# EAGLE design Shield_Carrito (EAGLE 9.5.1)
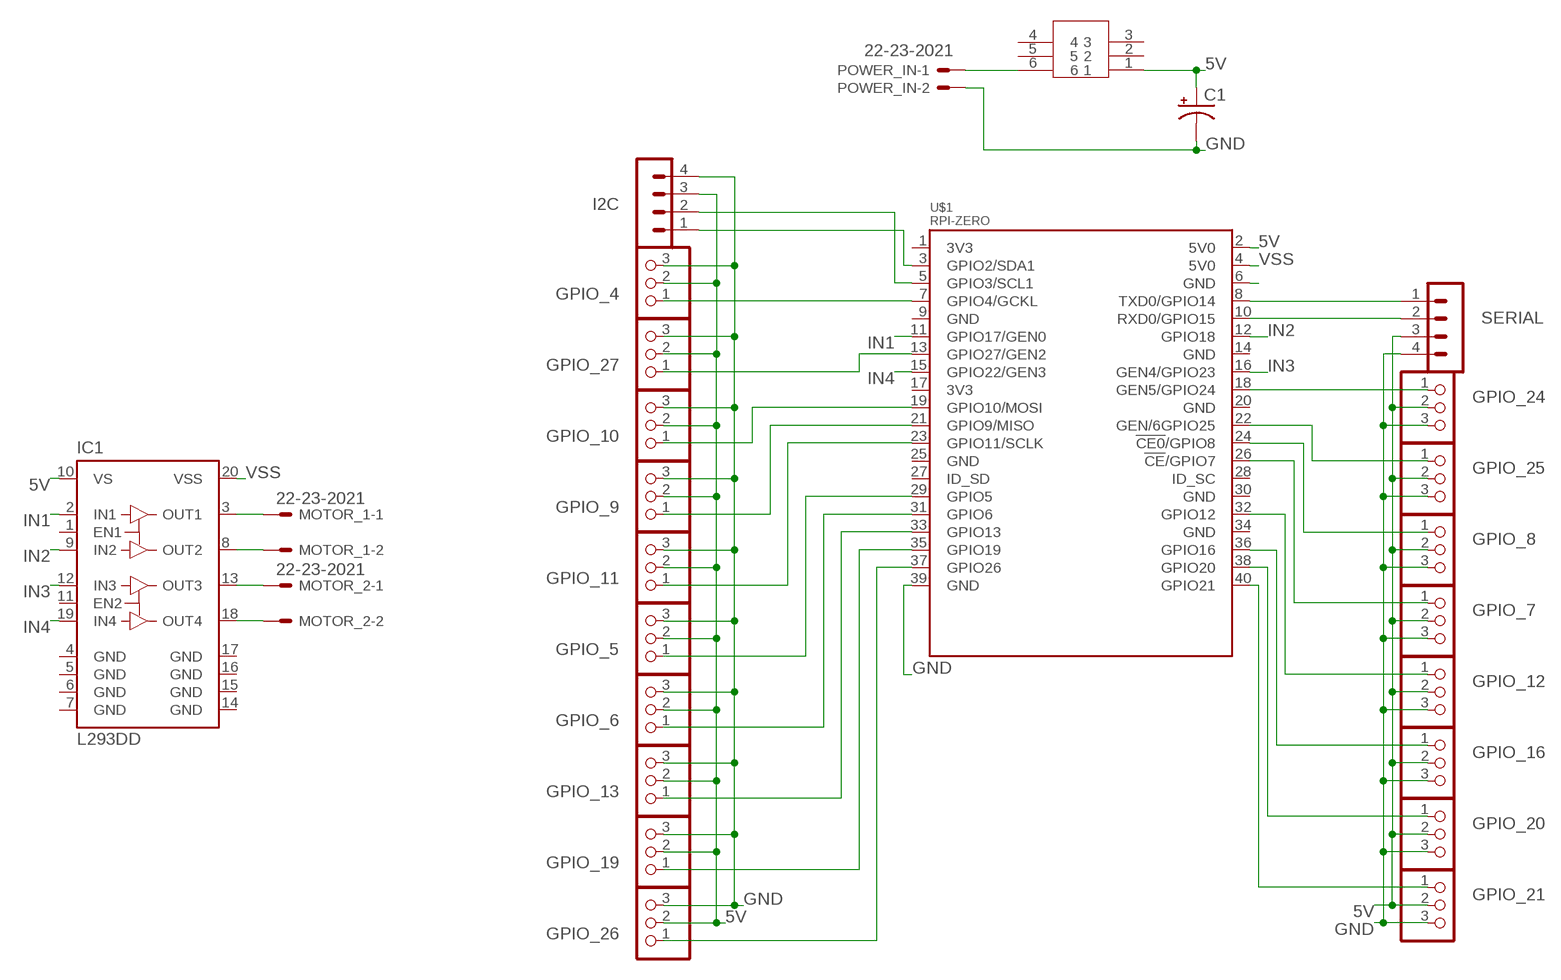
[diagram p0: schematic, sheet 1]

## Parts
C1  CPOL-USE2,5-6E  [E2,5-6E]
GPIO_4  PINHD-1X3  [1X03]
GPIO_5  PINHD-1X3  [1X03]
GPIO_6  PINHD-1X3  [1X03]
GPIO_7  PINHD-1X3  [1X03]
GPIO_8  PINHD-1X3  [1X03]
GPIO_9  PINHD-1X3  [1X03]
GPIO_10  PINHD-1X3  [1X03]
GPIO_11  PINHD-1X3  [1X03]
GPIO_12  PINHD-1X3  [1X03]
GPIO_13  PINHD-1X3  [1X03]
GPIO_16  PINHD-1X3  [1X03]
GPIO_19  PINHD-1X3  [1X03]
GPIO_20  PINHD-1X3  [1X03]
GPIO_21  PINHD-1X3  [1X03]
GPIO_24  PINHD-1X3  [1X03]
GPIO_25  PINHD-1X3  [1X03]
GPIO_26  PINHD-1X3  [1X03]
GPIO_27  PINHD-1X3  [1X03]
I2C  MA04-1  [MA04-1]
IC1  L293DD  [SO20]
MOTOR_1  22-23-2021  [22-23-2021]
MOTOR_2  22-23-2021  [22-23-2021]
POWER_IN  22-23-2021  [22-23-2021]
SERIAL  MA04-1  [MA04-1]
U$1  RPI-ZERO  [RASPBERRYPI_BASTELSTUBE_V13_RASPI_BOARD_B+_FULL]
U$2  PUSH_SWITCH_8X8  [PUSH_SWITCH_8X8]

## Nets
5V: C1.+ GPIO_4.2 GPIO_5.2 GPIO_6.2 GPIO_7.2 GPIO_8.2 GPIO_9.2 GPIO_10.2 GPIO_11.2 GPIO_12.2 GPIO_13.2 GPIO_16.2 GPIO_19.2 GPIO_20.2 GPIO_21.2 GPIO_24.2 GPIO_25.2 GPIO_26.2 GPIO_27.2 I2C.3 IC1.10(VS) SERIAL.3 U$1.2(5V0) U$2.1
GND: C1.- GPIO_4.3 GPIO_5.3 GPIO_6.3 GPIO_7.3 GPIO_8.3 GPIO_9.3 GPIO_10.3 GPIO_11.3 GPIO_12.3 GPIO_13.3 GPIO_16.3 GPIO_19.3 GPIO_20.3 GPIO_21.3 GPIO_24.3 GPIO_25.3 GPIO_26.3 GPIO_27.3 I2C.4 POWER_IN.2 SERIAL.4 U$1.6(GND) U$1.39(GND)
IN1: IC1.2(IN1) U$1.11(GPIO17/GEN0)
IN2: IC1.9(IN2) U$1.12(GPIO18)
IN3: IC1.12(IN3) U$1.16(GEN4/GPIO23)
IN4: IC1.19(IN4) U$1.15(GPIO22/GEN3)
N$1: GPIO_26.1 U$1.37(GPIO26)
N$2: GPIO_24.1 U$1.18(GEN5/GPIO24)
N$3: GPIO_25.1 U$1.22(GEN/6GPIO25)
N$4: GPIO_12.1 U$1.32(GPIO12)
N$5: GPIO_16.1 U$1.36(GPIO16)
N$7: GPIO_20.1 U$1.38(GPIO20)
N$8: GPIO_21.1 U$1.40(GPIO21)
N$10: GPIO_8.1 U$1.24(!CE0!/GPIO8)
N$11: GPIO_7.1 U$1.26(!CE!/GPIO7)
N$12: POWER_IN.1 U$2.6
N$15: IC1.13(OUT3) MOTOR_2.1
N$16: IC1.18(OUT4) MOTOR_2.2
N$17: IC1.3(OUT1) MOTOR_1.1
N$18: GPIO_27.1 U$1.13(GPIO27/GEN2)
N$19: GPIO_10.1 U$1.19(GPIO10/MOSI)
N$20: GPIO_11.1 U$1.23(GPIO11/SCLK)
N$21: GPIO_9.1 U$1.21(GPIO9/MISO)
N$22: GPIO_5.1 U$1.29(GPIO5)
N$23: GPIO_6.1 U$1.31(GPIO6)
N$24: GPIO_13.1 U$1.33(GPIO13)
N$25: GPIO_19.1 U$1.35(GPIO19)
N$26: GPIO_4.1 U$1.7(GPIO4/GCKL)
N$27: IC1.8(OUT2) MOTOR_1.2
N$28: I2C.2 U$1.5(GPIO3/SCL1)
N$30: I2C.1 U$1.3(GPIO2/SDA1)
N$31: SERIAL.1 U$1.8(TXD0/GPIO14)
N$32: SERIAL.2 U$1.10(RXD0/GPIO15)
VSS: IC1.20(VSS) U$1.4(5V0)
Unconnected: IC1.1(EN1) IC1.11(EN2) U$1.1(3V3) U$1.9(GND) U$1.14(GND) U$1.17(3V3) U$1.20(GND) U$1.25(GND) U$1.27(ID_SD) U$1.28(ID_SC) U$1.30(GND) U$1.34(GND) U$2.2 U$2.3 U$2.4 U$2.5

## Power pins joined to a net without a drawn wire
GND: IC1.4(GND) IC1.5(GND) IC1.6(GND) IC1.7(GND) IC1.14(GND) IC1.15(GND) IC1.16(GND) IC1.17(GND)

## Library data of the parts
C1 = rcl:CPOL-US: POLARIZED CAPACITOR, American symbol; SPICEPREFIX: C
GPIO_4-GPIO_13 GPIO_16 GPIO_19-GPIO_21 GPIO_24-GPIO_27 = adafruit:PINHD-1X3: PIN HEADER
I2C SERIAL = con-lstb:MA04-1: PIN HEADER; OC_FARNELL: unknown; OC_NEWARK: unknown
IC1 = st-microelectronics:L293DD: PUSH-PULL FOUR CHANNEL DRIVER WITH DIODES Source: http://www.st.com/stonline/books/pdf/docs/1330.pdf; OC_FARNELL: unknown
MOTOR_1 MOTOR_2 POWER_IN = con-molex:22-23-2021: .100" (2.54mm) Center Header - 2 Pin; MF: MOLEX; MPN: 22-23-2021; OC_FARNELL: 1462926; OC_NEWARK: 25C3832
U$1 = RASPBERRY_PI-Zero:RPI-ZERO
U$2 = Push_switch:PUSH_SWITCH_8X8

## Board
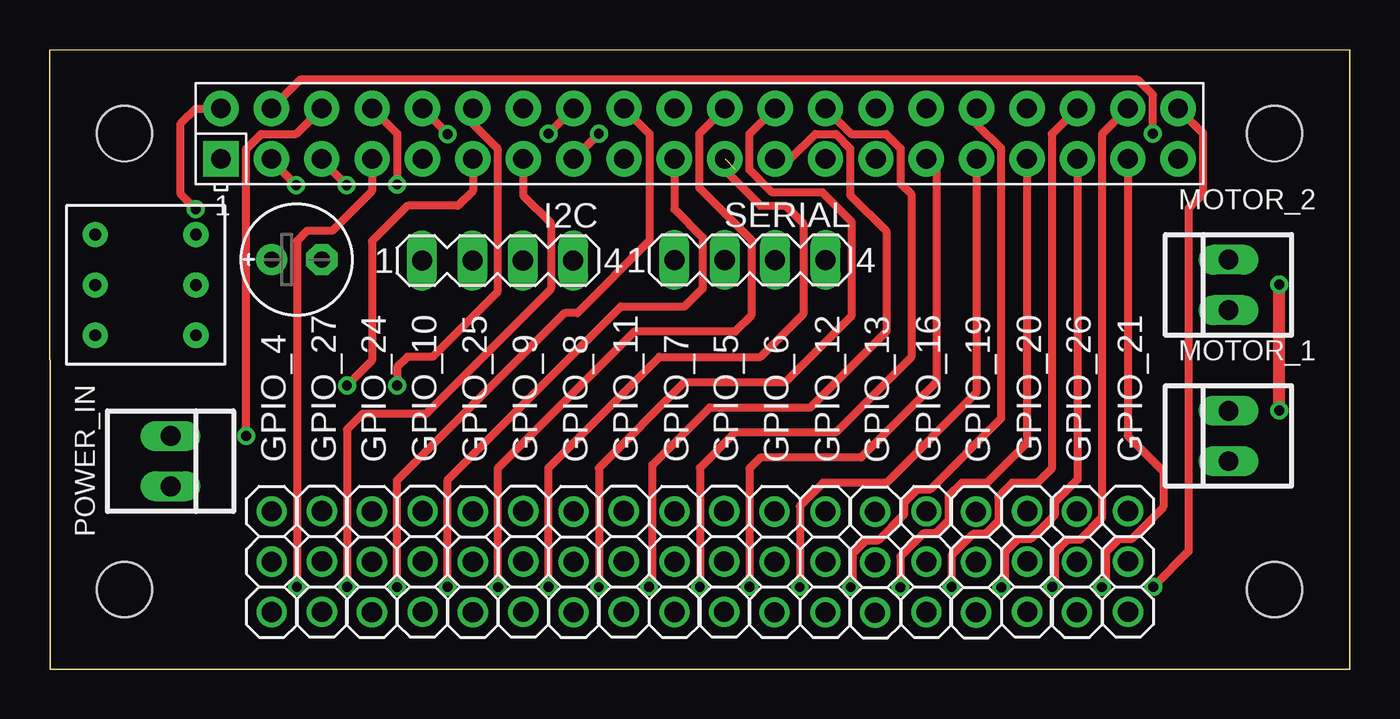
[diagram p1: board, top side]
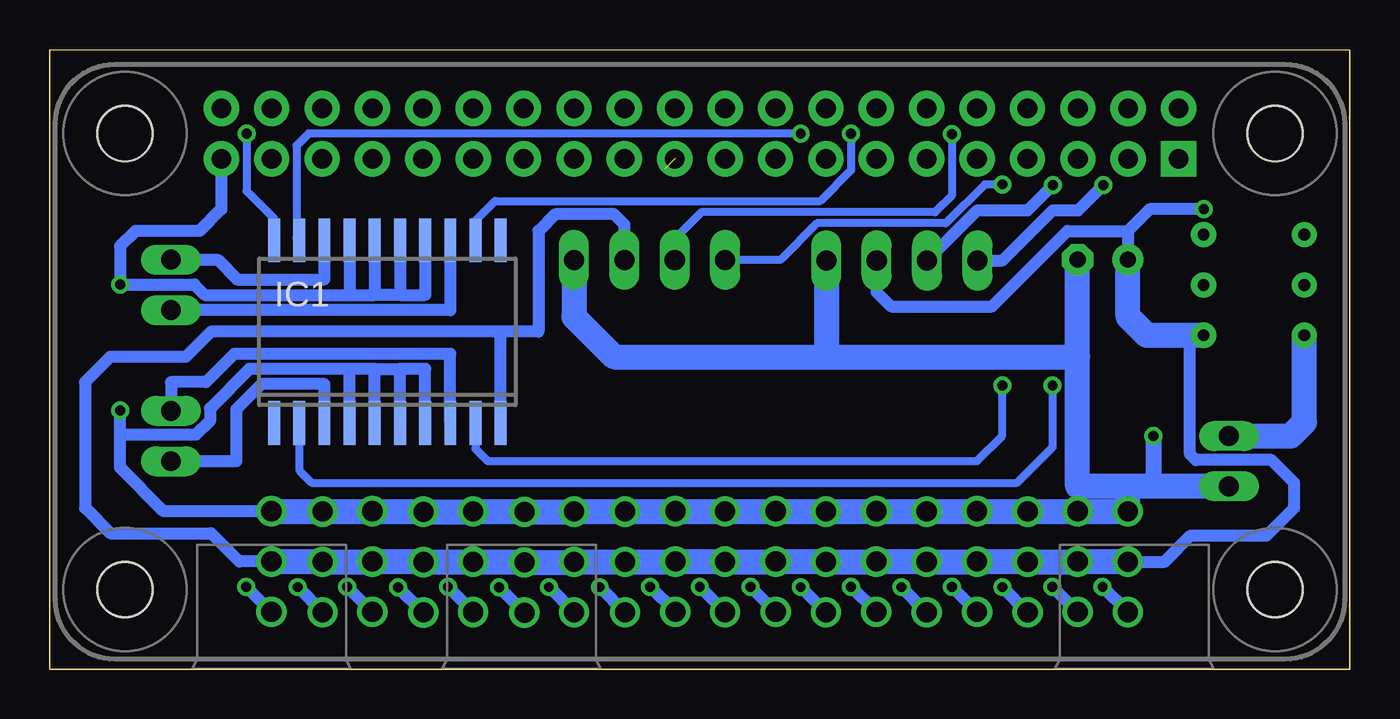
[diagram p2: board, bottom side, seen from below]

Size 65.56 x 31.26 mm. Coordinates in mm from the lower left corner, seen from the top.
Outline: 65.55,0 65.56,31.26 0,31.23 0.02,0 65.55,0
Copper layers (1*16): Top 0.035mm / dielectric 1.5mm / Bottom 0.035mm
Design rules "default": minimum track width 6mil, minimum drill 0.35mm, track to track 6mil, track to pad 6mil, pad to pad 6mil, via to via 6mil, smd to smd 6mil, copper to edge 40mil, drill to drill 6mil, minimum pad ring 10mil, minimum via ring 8mil, stop-mask expansion 4mil, vias tented up to drill 0mil, thermal gap 10mil
Holes 2.8 mm at 3.77,27.02 3.77,4.02 61.77,27.02 61.77,4.02

### Footprints (pad centres in the part's own frame; a part is rotated, then mirrored left to right if it is on the bottom)
E2,5-6E = drill 0.813 pad 1.575: + -1.27,0 | drill 0.813 pad 1.575 octagon: - 1.27,0
1X03 = drill 1.016: 1 -2.54,0; 2 0,0; 3 2.54,0
MA04-1 = drill 1.016 long: 1 -3.81,0; 2 -1.27,0; 3 1.27,0; 4 3.81,0
SO20 = smd 0.6 x 2.2: 1 -5.715,-4.6; 2 -4.445,-4.6; 3 -3.175,-4.6; 4 -1.905,-4.6; 5 -0.635,-4.6; 6 0.635,-4.6; 7 1.905,-4.6; 8 3.175,-4.6; 9 4.445,-4.6; 10 5.715,-4.6; 11 5.715,4.6; 12 4.445,4.6; 13 3.175,4.6; 14 1.905,4.6; 15 0.635,4.6; 16 -0.635,4.6; 17 -1.905,4.6; 18 -3.175,4.6; 19 -4.445,4.6; 20 -5.715,4.6
22-23-2021 = drill 1 long: 1 -1.27,0; 2 1.27,0
RASPBERRYPI_BASTELSTUBE_V13_RASPI_BOARD_B+_FULL = drill 1 pad 1.778 square: 1 8.37,25.23 | drill 1 pad 1.778: 2 8.37,27.77; 3 10.91,25.23; 4 10.91,27.77; 5 13.45,25.23; 6 13.45,27.77; 7 15.99,25.23; 8 15.99,27.77; 9 18.53,25.23; 10 18.53,27.77; 11 21.07,25.23; 12 21.07,27.77; 13 23.61,25.23; 14 23.61,27.77; 15 26.15,25.23; 16 26.15,27.77; 17 28.69,25.23; 18 28.69,27.77; 19 31.23,25.23; 20 31.23,27.77; 21 33.77,25.23; 22 33.77,27.77; 23 36.31,25.23; 24 36.31,27.77; 25 38.85,25.23; 26 38.85,27.77; 27 41.39,25.23; 28 41.39,27.77; 29 43.93,25.23; 30 43.93,27.77; 31 46.47,25.23; 32 46.47,27.77; 33 49.01,25.23; 34 49.01,27.77; 35 51.55,25.23; 36 51.55,27.77; 37 54.09,25.23; 38 54.09,27.77; 39 56.63,25.23; 40 56.63,27.77 | hole 2.75: 3.5,3.5; 3.5,26.5; 61.5,3.5; 61.5,26.5
PUSH_SWITCH_8X8 = drill 0.6 pad 1.27: 1 -2.54,2.54; 2 -2.54,0; 3 -2.54,-2.54; 4 2.54,-2.54; 5 2.54,0; 6 2.54,2.54

### Placement (x,y rotation side)
C1  12.46,20.67 0 top
GPIO_4  11.2,5.43 90 top
GPIO_5  34.01,5.44 90 top
GPIO_6  36.55,5.42 90 top
GPIO_7  31.51,5.43 90 top
GPIO_8  26.42,5.42 90 top
GPIO_9  23.88,5.44 90 top
GPIO_10  18.8,5.44 90 top
GPIO_11  28.95,5.44 90 top
GPIO_12  39.12,5.42 90 top
GPIO_13  41.62,5.4 90 top
GPIO_16  44.21,5.43 90 top
GPIO_19  46.71,5.41 90 top
GPIO_20  49.29,5.44 90 top
GPIO_21  54.38,5.44 90 top
GPIO_24  16.25,5.42 90 top
GPIO_25  21.34,5.42 90 top
GPIO_26  51.79,5.42 90 top
GPIO_27  13.73,5.44 90 top
I2C  22.59,20.62 0 top
IC1  48.53,17.03 0 bottom
MOTOR_1  59.44,11.77 90 top
MOTOR_2  59.44,19.39 90 top
POWER_IN  6.1,10.5 270 top
SERIAL  35.31,20.65 0 top
U$1  0.27,0.52 0 top
U$2  4.84,19.39 180 top

### Tracks (layer width: path | path; a pad name or v marks a point on that pad's centre or on a via)
5V  (via drill 0.5)
  Top 0.406: v7.37,23.21 6.62,23.96 6.62,27.54 7.37,28.29 U$1.2
  Bottom 0.406: 54.41,5.44 GPIO_21.2
  Bottom 0.61: GPIO_21.2 55.99,5.44 57.42,6.87 62.5,6.87 63.77,8.14 63.77,14.49 62.5,15.76 58.69,15.76 57.42,17.03 42.82,17.03 | IC1.10 42.82,17.03 | SERIAL.3 36.58,22.44 37.1,22.96 40.06,22.96 40.91,22.11 40.91,17.03 42.82,17.03 | I2C.3 23.86,19.03 23.13,18.3 18.05,18.3 14.24,22.11 11.19,22.11 | 11.19,22.11 C1.+ | v7.37,23.21 10.09,23.21 11.19,22.11 | GPIO_4.2 9.33,5.43 8.01,6.75 4.2,6.75 2.81,8.14 2.81,9.41 3.96,10.56 7.77,10.56 8.06,10.86 8.06,16.85 9.16,16.85
  Bottom 1.27: U$2.1 9.16,16.85 10.25,16.85 11.19,17.79 C1.+ | GPIO_21.2 51.79,5.44 GPIO_26.2 49.29,5.42 GPIO_20.2 46.71,5.44 GPIO_19.2 44.21,5.41 GPIO_16.2 41.62,5.43 GPIO_13.2 39.12,5.4 GPIO_12.2 GPIO_6.2 34.01,5.42 GPIO_5.2 GPIO_7.2 GPIO_11.2 26.42,5.44 GPIO_8.2 23.88,5.42 GPIO_9.2 21.34,5.44 GPIO_25.2 18.8,5.42 GPIO_10.2 16.25,5.44 GPIO_24.2 13.73,5.42 GPIO_27.2 GPIO_4.2
GND  (via drill 0.5)
  Top 0.406: U$1.6 12.42,27 10.66,27 9.91,26.24 v9.91,11.78
  Top 0.61: v62,13.06 v62,19.41
  Bottom 0.406: GPIO_21.3 54.38,8.14
  Bottom 0.61: IC1.7 46.62,15.15 47.9,15.15 | 49.17,15.15 50.44,15.15 | 50.44,15.15 55.49,15.15 57.48,13.16 57.48,12.54 58.18,11.83 61.88,11.83 62,11.95 | IC1.6 47.9,15.15 | IC1.5 49.17,15.15 | 49.17,15.15 47.9,15.15 | IC1.4 50.44,15.15 | GPIO_21.3 59.8,7.98 62,10.18 62,11.95 | IC1.14 46.62,18.88 47.9,18.88 | 47.9,18.88 49.17,18.88 | 50.44,18.88 57.74,18.88 58.26,19.41 v62,19.41 62,21.34 61.23,22.11 58,22.11 56.9,23.21 U$1.39 | IC1.15 47.9,18.88 | IC1.16 49.17,18.88 | IC1.17 50.44,18.88 | 50.44,18.88 49.17,18.88 | 62,11.95 v62,13.06
  Bottom 0.813: v9.91,11.78 9.91,9.23 9.16,9.23
  Bottom 1.27: POWER_IN.2 9.16,9.23 11.2,9.23 | 11.2,9.23 13.73,9.23 13.73,15.76 | 13.73,15.76 C1.- | GPIO_21.3 51.79,7.98 GPIO_26.3 49.29,7.96 GPIO_20.3 46.71,7.98 GPIO_19.3 44.21,7.95 GPIO_16.3 41.62,7.97 GPIO_13.3 39.12,7.94 GPIO_12.3 GPIO_6.3 34.01,7.96 GPIO_5.3 GPIO_7.3 GPIO_11.3 26.42,7.98 GPIO_8.3 23.88,7.96 GPIO_9.3 21.34,7.98 GPIO_25.3 18.8,7.96 GPIO_10.3 16.25,7.98 GPIO_24.3 13.73,7.96 GPIO_27.3 GPIO_4.3 11.2,9.23 | SERIAL.4 39.12,17.78 37.1,15.76 26.4,15.76 | 26.4,15.76 13.73,15.76 | I2C.4 26.4,15.76
IN1  (via drill 0.5)
  Top 0.406: U$1.11 21.34,24.13 20.59,23.38 18.05,23.38 16.26,21.59 16.26,15.59 v14.99,14.32
  Bottom 0.406: IC1.2 52.98,10.04 52.34,9.41 16.78,9.41 14.99,11.2 v14.99,14.32
IN2  (via drill 0.5)
  Top 0.406: U$1.12 21.34,27.51 22.59,26.27 22.59,19.02 19.32,15.76 18.05,15.76 17.53,15.24 v17.53,14.32
  Bottom 0.406: IC1.9 44.09,11.13 43.47,10.51 18.8,10.51 17.53,11.78 v17.53,14.32
IN3  (via drill 0.5)
  Top 0.406: v25.15,27.02 U$1.16
  Bottom 0.406: v25.15,27.02 25.15,25.17 26.7,23.62 43.1,23.62 44.09,22.63 IC1.12
IN4  (via drill 0.5)
  Top 0.406: v27.69,27.02 U$1.15
  Bottom 0.406: v27.69,27.02 52.51,27.02 53.12,26.41 53.12,21.77 IC1.19
N$1  (via drill 0.5)
  Top 0.406: U$1.37 54.36,11.78 56.15,9.99 56.15,8.17 54.54,6.56 53.92,6.56 53.26,5.9 53.26,4.35 v53.06,4.15
  Bottom 0.61: v53.06,4.15 GPIO_26.1
N$2  (via drill 0.5)
  Top 0.406: U$1.18 30.25,27 30.25,21.61 26.61,17.97 25.96,17.97 17.52,9.53 v17.52,4.15
  Bottom 0.61: GPIO_24.1 v17.52,4.15
N$3  (via drill 0.5)
  Top 0.406: U$1.22 32.75,27 32.75,24.29 35.38,21.66 | 35.38,21.66 35.46,21.57 | v22.61,4.15 22.61,10.16 29.48,17.03 34.56,17.03 35.38,17.85 35.38,21.66
  Bottom 0.61: GPIO_25.1 v22.61,4.15
N$4  (via drill 0.5)
  Top 0.406: U$1.32 46.74,27.51 47.99,26.27 47.99,12.67 44.4,9.09 43.75,9.09 43.09,8.43 43.09,7.83 41.78,6.52 41.16,6.52 40.5,5.86 40.5,4.26 v40.39,4.15
  Bottom 0.61: v40.39,4.15 GPIO_12.1
N$5  (via drill 0.5)
  Top 0.406: U$1.36 50.53,27 50.53,10.13 49.8,9.41 48.53,9.41 47.83,8.71 47.83,7.49 47.17,6.83 46.55,6.83 45.48,5.76 v45.48,4.16
  Bottom 0.61: v45.48,4.16 GPIO_16.1
N$7  (via drill 0.5)
  Top 0.406: U$1.38 53.07,27 53.07,7.65 51.95,6.54 51.33,6.54 50.67,5.88 50.67,4.28 v50.56,4.17
  Bottom 0.61: v50.56,4.17 GPIO_20.1
N$8  (via drill 0.5)
  Top 0.406: U$1.40 58.15,27.04 58.15,23.96 57.42,23.24 57.42,5.94 v55.65,4.17
  Bottom 0.61: v55.65,4.17 GPIO_21.1
N$10  (via drill 0.5)
  Top 0.406: v27.69,4.15 27.69,10.16 32.02,14.49 37.1,14.49 40.45,17.85 40.45,22.57 38.97,24.05 37.1,24.05 36.59,24.05 36.43,24.05 35.29,25.2 35.29,27 U$1.24
  Bottom 0.61: GPIO_8.1 v27.69,4.15
N$11  (via drill 0.5)
  Top 0.406: U$1.26 39.86,27.55 39.87,27.55 40.43,27 42.18,27 42.91,26.27 42.91,24.5 43.45,23.96 43.45,15.76 39.64,11.95 34.56,11.95 32.78,10.17 v32.78,4.16
  Bottom 0.61: GPIO_7.1 v32.78,4.16
N$12
  Bottom 1.27: POWER_IN.1 2.99,11.77 2.3,12.46 U$2.6
N$15
  Bottom 0.61: IC1.13 45.36,18.12 MOTOR_2.1
N$16
  Bottom 0.61: IC1.18 51.71,19.67 56.11,19.67 57.1,20.66 MOTOR_2.2
N$17
  Bottom 0.61: IC1.3 51.71,14.39 54.88,14.39 56.15,13.12 56.15,10.5 MOTOR_1.1
N$18  (via drill 0.5)
  Top 0.406: U$1.13 23.88,23.9 25.28,22.5 25.28,19.18 18.99,12.89 15.79,12.89 15,12.1 v15,4.17
  Bottom 0.61: GPIO_27.1 v15,4.17
N$19  (via drill 0.5)
  Top 0.406: U$1.19 31.5,23.21 32.92,21.79 32.92,19.2 32.02,18.3 28.81,18.3 20.07,9.56 v20.07,4.17
  Bottom 0.61: GPIO_10.1 v20.07,4.17
N$20  (via drill 0.5)
  Top 0.406: U$1.23 37.36,25.75 38.6,27 39.64,27 40.37,26.27 40.37,23.93 42.18,22.11 42.18,17.03 38.37,13.22 33.29,13.22 30.39,10.32 30.39,4.34 v30.22,4.17
  Bottom 0.61: GPIO_11.1 v30.22,4.17
N$21  (via drill 0.5)  (1 unrouted)
  Top 0.305: 34.56,25.23
  Top 0.406: U$1.21 34.04,25.17 35.83,23.38 37.1,23.38 38,22.48 38,17.93 35.83,15.76 30.75,15.76 25.15,10.16 v25.15,4.17
  Bottom 0.61: GPIO_9.1 v25.15,4.17
N$22  (via drill 0.5)
  Top 0.406: v35.28,4.17 35.28,10.13 35.83,10.68 40.91,10.68 44.72,14.49 44.72,25.23 U$1.29
  Bottom 0.61: GPIO_5.1 v35.28,4.17
N$23  (via drill 0.5)
  Top 0.406: U$1.31 46.74,13.97 42.18,9.41 38.99,9.41 37.82,8.24 v37.82,4.15
  Bottom 0.61: GPIO_6.1 v37.82,4.15
N$24  (via drill 0.5)
  Top 0.406: U$1.33 49.28,11.43 47.26,9.41 45.99,9.41 45.33,8.75 45.33,7.51 44.67,6.85 44.05,6.85 42.89,5.69 v42.89,4.13
  Bottom 0.61: v42.89,4.13 GPIO_13.1
N$25  (via drill 0.5)
  Top 0.406: U$1.35 51.82,9.57 50.67,8.42 50.67,7.78 49.45,6.56 48.83,6.56 48.17,5.9 48.17,4.33 v47.98,4.14
  Bottom 0.61: v47.98,4.14 GPIO_19.1
N$26  (via drill 0.5)
  Top 0.406: U$1.7 16.26,24.13 14.24,22.11 12.97,22.11 12.47,21.61 v12.47,4.16
  Bottom 0.61: GPIO_4.1 v12.47,4.16
N$27
  Bottom 0.61: IC1.8 45.36,15.91 56.25,15.91 57.67,14.49 59.44,14.49 MOTOR_1.2
N$28  (via drill 0.5)
  Top 0.406: v14.97,24.43 13.72,25.68 U$1.5
  Bottom 0.61: I2C.2 18.78,23.16 16.24,23.16 v14.97,24.43
N$30  (via drill 0.5)
  Top 0.406: v12.43,24.43 11.18,25.68 U$1.3
  Bottom 0.61: I2C.1 17.51,20.62 14.97,23.16 13.7,23.16 v12.43,24.43
N$31  (via drill 0.5)
  Top 0.406: U$1.8 17.53,27.02 v17.53,24.46
  Bottom 0.406: v17.53,24.46 18.41,24.46 20.37,22.5 26.86,22.5 28.71,20.65 SERIAL.1
N$32  (via drill 0.5)
  Top 0.406: U$1.10 20.07,27.02 v20.07,27
  Bottom 0.406: v20.07,27 20.07,23.9 20.91,23.06 32.7,23.06 34.04,21.72 SERIAL.2
VSS  (via drill 0.5)
  Top 0.406: v55.63,27.02 55.63,28.98 54.88,29.73 12.62,29.73 U$1.4
  Bottom 0.406: v55.63,27.02 55.63,24.13 54.25,22.75 IC1.20